# EAGLE board csa_petcpu_v1.1b (EAGLE 4.15), part 1 of 2
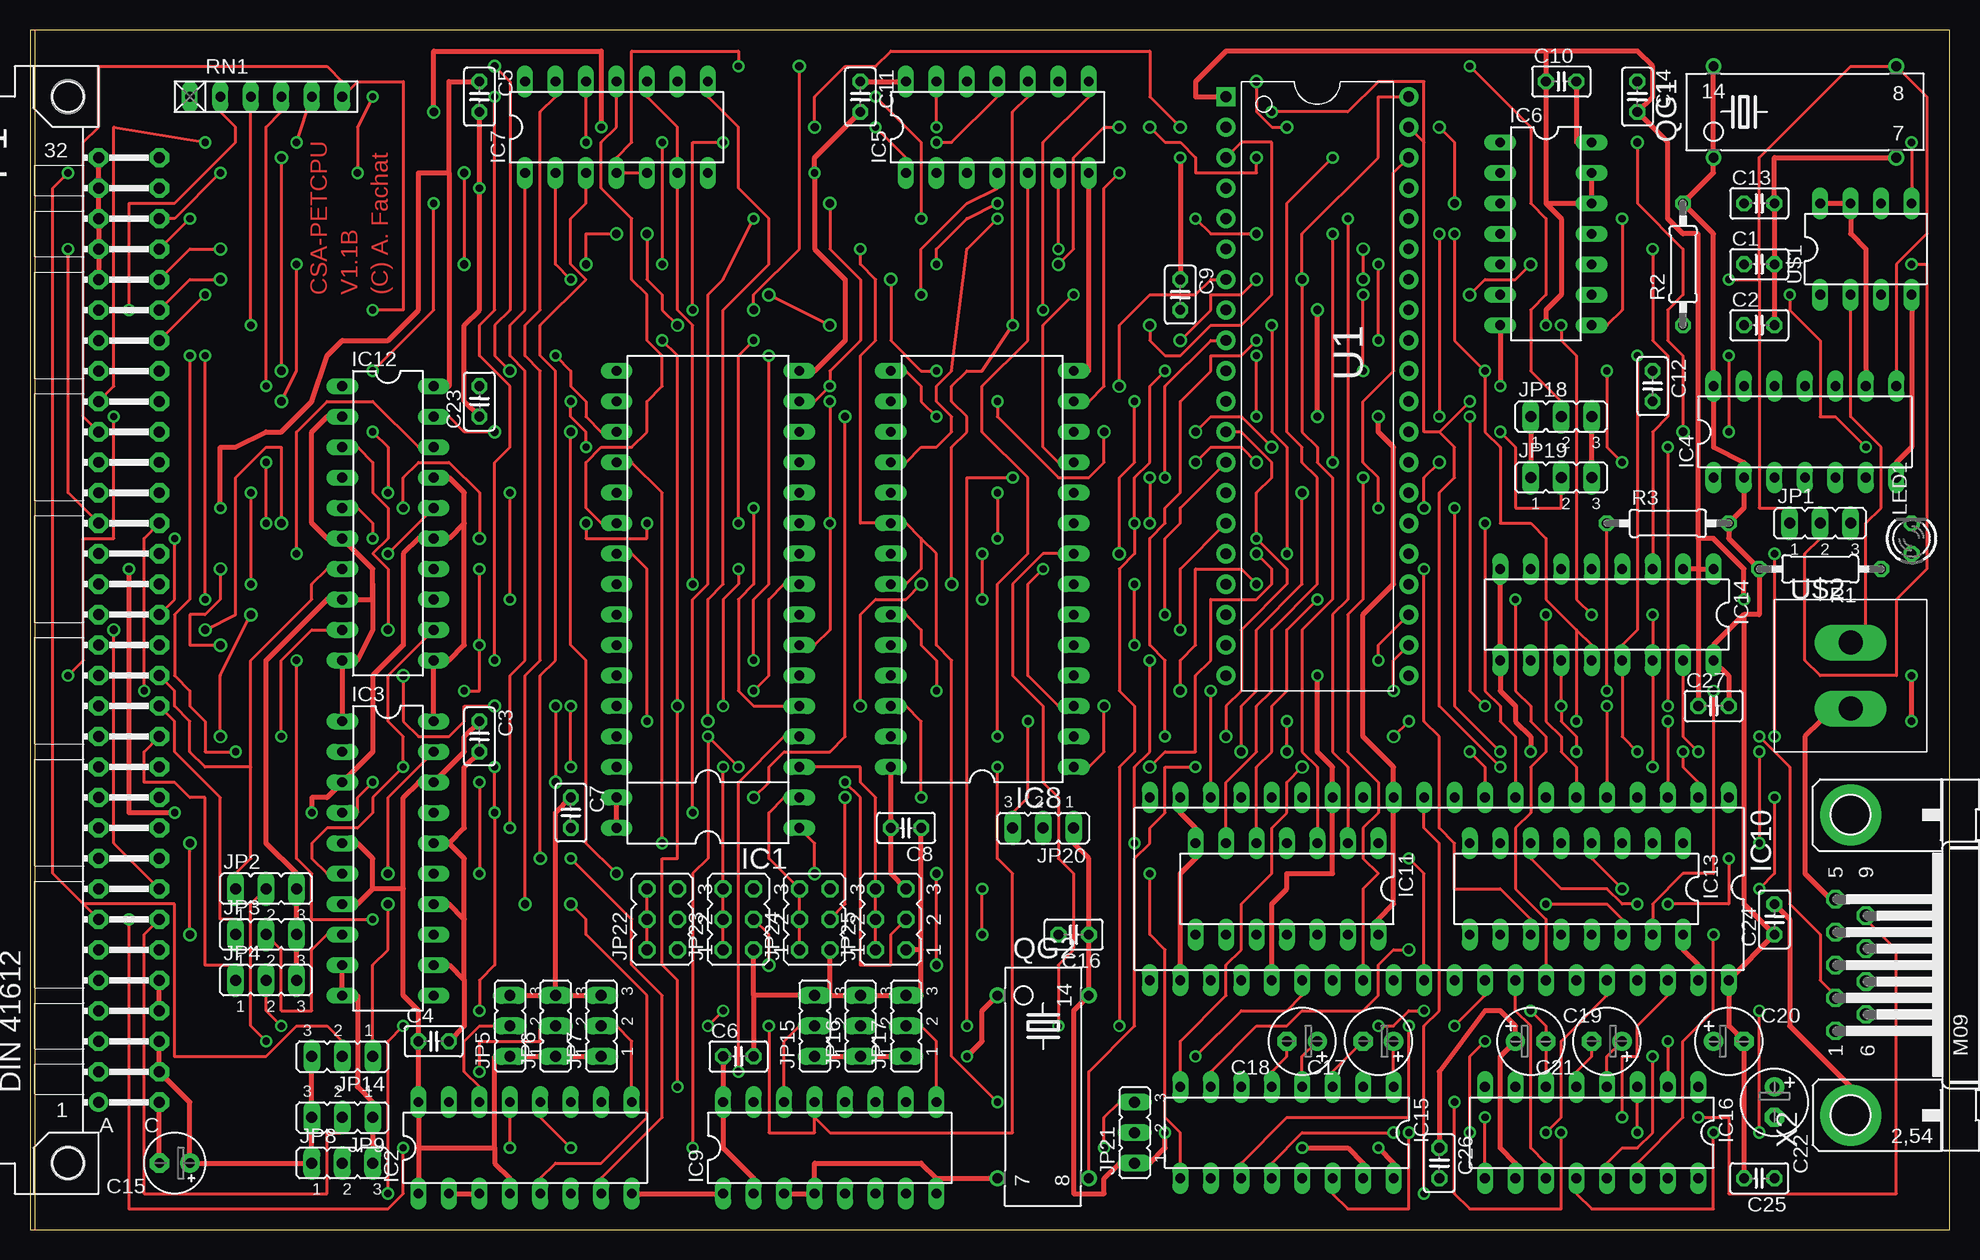
[diagram p2: board, top side]
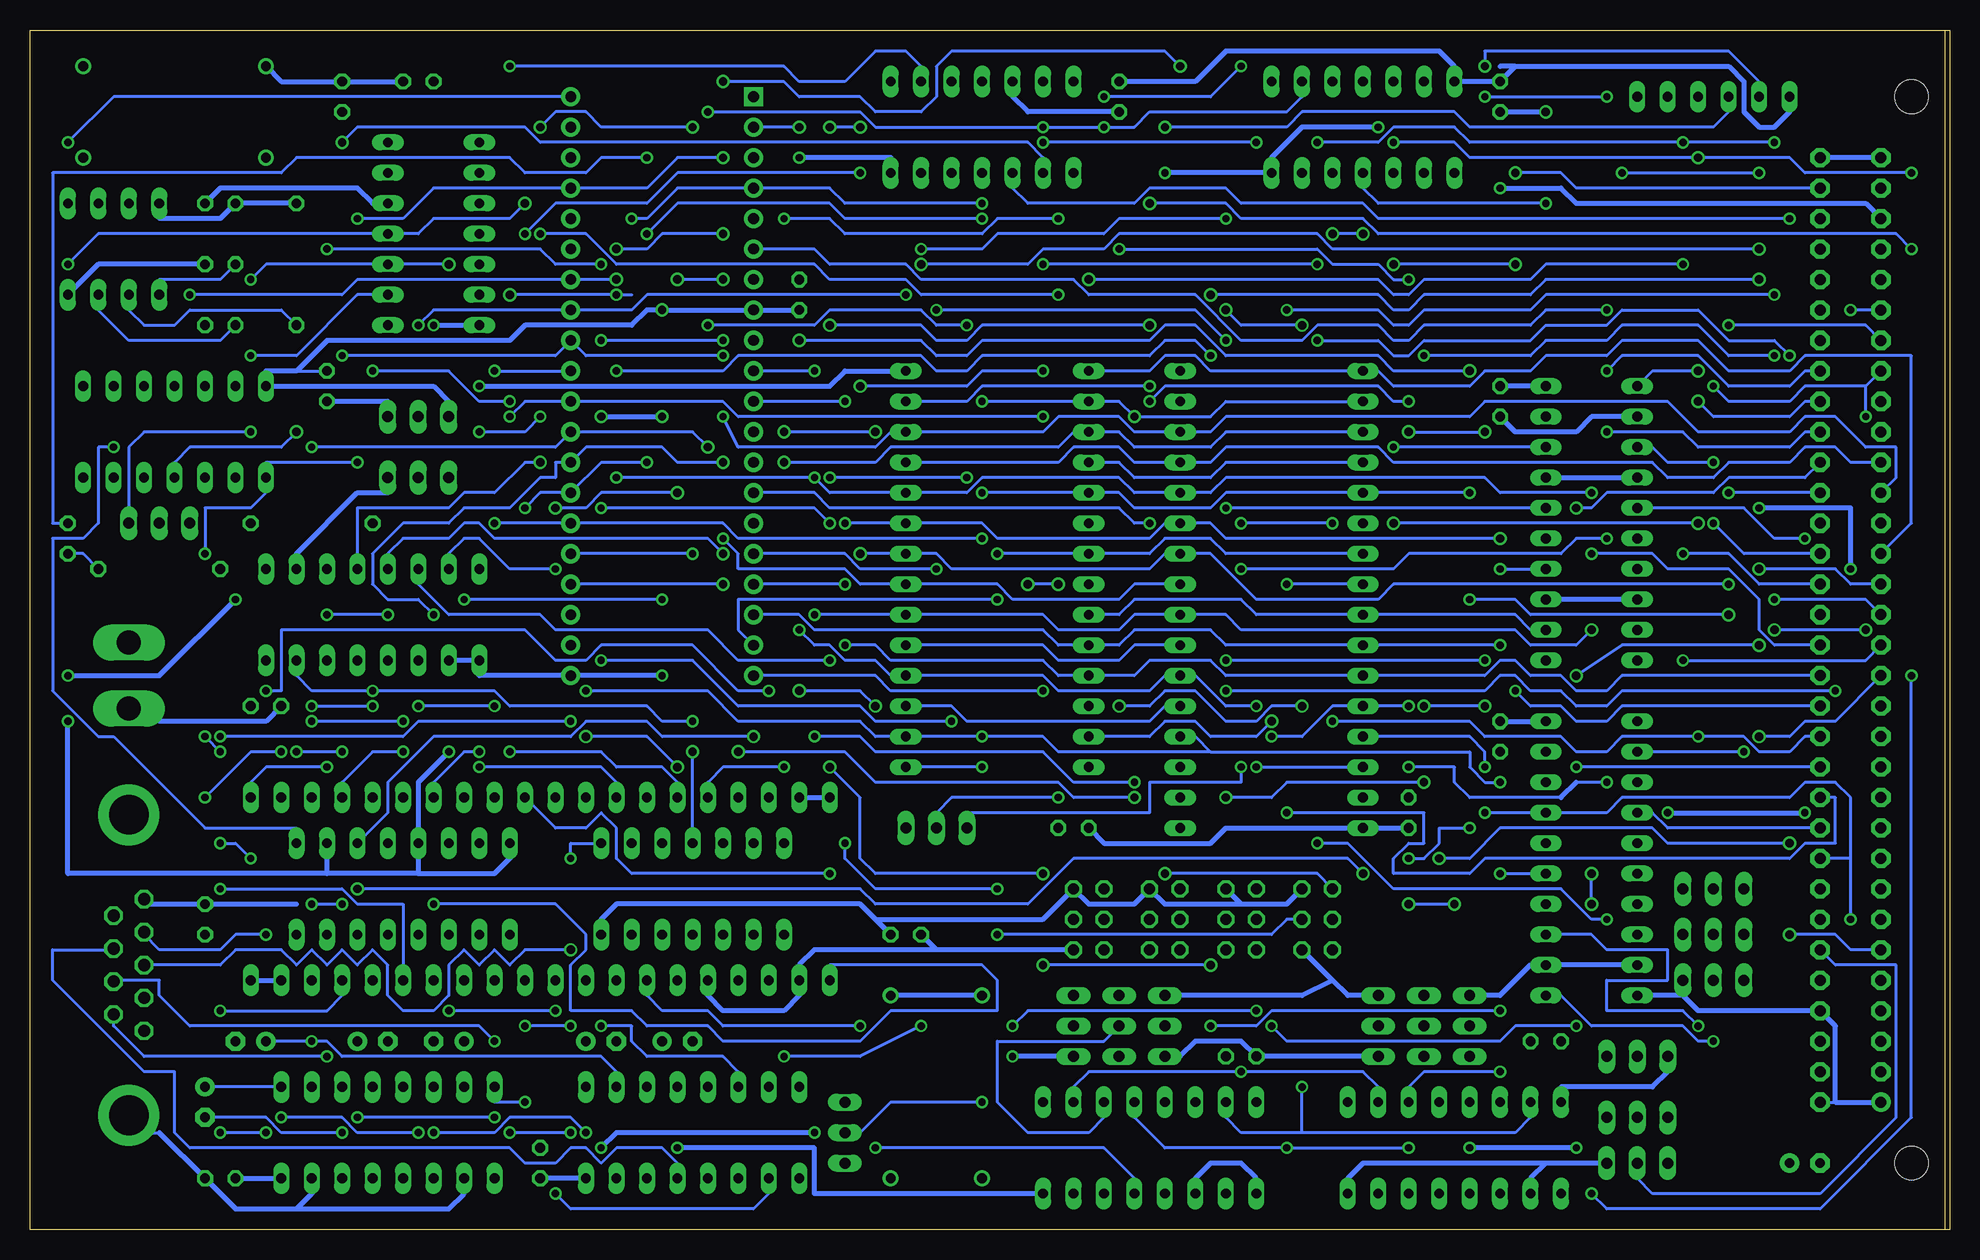
[diagram p3: board, bottom side, seen from below]

Size 160 x 100.03 mm. Coordinates in mm from the lower left corner, seen from the top.
Outline: 0,0.01 160,0.01 160,100.01 0,100.01 0,0.01
Copper layers (1*16): Top 0.035mm / dielectric 1.5mm / Bottom 0.035mm
Design rules "default": minimum track width 10mil, minimum drill 24mil, track to track 8mil, track to pad 8mil, pad to pad 8mil, via to via 8mil, smd to smd 8mil, copper to edge 40mil, drill to drill 8mil, minimum pad ring 10mil, minimum via ring 8mil, stop-mask expansion 4mil, vias tented up to drill 0mil, thermal gap 10mil

## Footprints (pad centres in the part's own frame; a part is rotated, then mirrored left to right if it is on the bottom)
C025-025X050 = drill 0.813 octagon: 1 -1.27,0; 2 1.27,0
E2,5-5 = drill 0.813 pad 1.6 round: + -1.27,0 | drill 0.813 pad 1.6 octagon: - 1.27,0
E2,5-6 = drill 0.813 pad 1.6 round: + -1.27,0 | drill 0.813 pad 1.6 octagon: - 1.27,0
DIL32OPT28 = drill 0.813 long: 1 -19.05,-7.62; 2 -16.51,-7.62; 3 -13.97,-7.62; 4 -11.43,-7.62; 5 -8.89,-7.62; 6 -6.35,-7.62; 7 -3.81,-7.62; 8 -1.27,-7.62; 9 1.27,-7.62; 10 3.81,-7.62; 11 6.35,-7.62; 12 8.89,-7.62; 13 11.43,-7.62; 14 13.97,-7.62; 15 16.51,-7.62; 16 19.05,-7.62; 17 19.05,7.62; 18 16.51,7.62; 19 13.97,7.62; 20 11.43,7.62; 21 8.89,7.62; 22 6.35,7.62; 23 3.81,7.62; 24 1.27,7.62; 25 -1.27,7.62; 26 -3.81,7.62; 27 -6.35,7.62; 28 -8.89,7.62; 29 -11.43,7.62; 30 -13.97,7.62; 31 -16.51,7.62; 32 -19.05,7.62
DIL16 = drill 0.813 long: 1 -8.89,-3.81; 2 -6.35,-3.81; 3 -3.81,-3.81; 4 -1.27,-3.81; 5 1.27,-3.81; 6 3.81,-3.81; 7 6.35,-3.81; 8 8.89,-3.81; 9 8.89,3.81; 10 6.35,3.81; 11 3.81,3.81; 12 1.27,3.81; 13 -1.27,3.81; 14 -3.81,3.81; 15 -6.35,3.81; 16 -8.89,3.81
DIL20 = drill 0.813 long: 1 -10.16,-3.81; 2 -7.62,-3.81; 3 -5.08,-3.81; 4 -2.54,-3.81; 5 0,-3.81; 6 2.54,-3.81; 7 5.08,-3.81; 8 7.62,-3.81; 9 10.16,-3.81; 10 12.7,-3.81; 11 12.7,3.81; 12 10.16,3.81; 13 7.62,3.81; 14 5.08,3.81; 15 2.54,3.81; 16 0,3.81; 17 -2.54,3.81; 18 -5.08,3.81; 19 -7.62,3.81; 20 -10.16,3.81
DIL14 = drill 0.813 long: 1 -7.62,-3.81; 2 -5.08,-3.81; 3 -2.54,-3.81; 4 0,-3.81; 5 2.54,-3.81; 6 5.08,-3.81; 7 7.62,-3.81; 8 7.62,3.81; 9 5.08,3.81; 10 2.54,3.81; 11 0,3.81; 12 -2.54,3.81; 13 -5.08,3.81; 14 -7.62,3.81
DIL28 = drill 0.813 long: 1 -13.97,-7.62; 2 -11.43,-7.62; 3 -8.89,-7.62; 4 -6.35,-7.62; 5 -3.81,-7.62; 6 -1.27,-7.62; 7 1.27,-7.62; 8 3.81,-7.62; 9 6.35,-7.62; 10 8.89,-7.62; 11 11.43,-7.62; 12 13.97,-7.62; 13 16.51,-7.62; 14 19.05,-7.62; 15 19.05,7.62; 16 16.51,7.62; 17 13.97,7.62; 18 11.43,7.62; 19 8.89,7.62; 20 6.35,7.62; 21 3.81,7.62; 22 1.27,7.62; 23 -1.27,7.62; 24 -3.81,7.62; 25 -6.35,7.62; 26 -8.89,7.62; 27 -11.43,7.62; 28 -13.97,7.62
DIL40 = drill 0.813 long: 1 -16.51,-7.62; 2 -13.97,-7.62; 3 -11.43,-7.62; 4 -8.89,-7.62; 5 -6.35,-7.62; 6 -3.81,-7.62; 7 -1.27,-7.62; 8 1.27,-7.62; 9 3.81,-7.62; 10 6.35,-7.62; 11 8.89,-7.62; 12 11.43,-7.62; 13 13.97,-7.62; 14 16.51,-7.62; 15 19.05,-7.62; 16 21.59,-7.62; 17 24.13,-7.62; 18 26.67,-7.62; 19 29.21,-7.62; 20 31.75,-7.62; 21 31.75,7.62; 22 29.21,7.62; 23 26.67,7.62; 24 24.13,7.62; 25 21.59,7.62; 26 19.05,7.62; 27 16.51,7.62; 28 13.97,7.62; 29 11.43,7.62; 30 8.89,7.62; 31 6.35,7.62; 32 3.81,7.62; 33 1.27,7.62; 34 -1.27,7.62; 35 -3.81,7.62; 36 -6.35,7.62; 37 -8.89,7.62; 38 -11.43,7.62; 39 -13.97,7.62; 40 -16.51,7.62
JP2 = drill 0.914 long: 1 -2.54,0; 2 0,0; 3 2.54,0
JP3Q = drill 0.914 octagon: 1 -2.54,-1.27; 2 -2.54,1.27; 3 0,-1.27; 4 0,1.27; 5 2.54,-1.27; 6 2.54,1.27
LED3MM = drill 0.813 octagon: A -1.27,0; K 1.27,0
CSABUS = drill 0.914 pad 1.6 round: A1 7.62,36.83 | drill 0.914 pad 1.6 octagon: A2 7.62,34.29; A3 7.62,31.75; A4 7.62,29.21; A5 7.62,26.67; A6 7.62,24.13; A7 7.62,21.59; A8 7.62,19.05; A9 7.62,16.51; A10 7.62,13.97; A11 7.62,11.43; A12 7.62,8.89; A13 7.62,6.35; A14 7.62,3.81; A15 7.62,1.27; A16 7.62,-1.27; A17 7.62,-3.81; A18 7.62,-6.35; A19 7.62,-8.89; A20 7.62,-11.43; A21 7.62,-13.97; A22 7.62,-16.51; A23 7.62,-19.05; A24 7.62,-21.59; A25 7.62,-24.13; A26 7.62,-26.67; A27 7.62,-29.21; A28 7.62,-31.75; A29 7.62,-34.29; A30 7.62,-36.83; A31 7.62,-39.37; A32 7.62,-41.91; C1 2.54,36.83; C2 2.54,34.29; C3 2.54,31.75; C4 2.54,29.21; C5 2.54,26.67; C6 2.54,24.13; C7 2.54,21.59; C8 2.54,19.05; C9 2.54,16.51; C10 2.54,13.97; C11 2.54,11.43; C12 2.54,8.89; C13 2.54,6.35; C14 2.54,3.81; C15 2.54,1.27; C16 2.54,-1.27; C17 2.54,-3.81; C18 2.54,-6.35; C19 2.54,-8.89; C20 2.54,-11.43; C21 2.54,-13.97; C22 2.54,-16.51; C23 2.54,-19.05; C24 2.54,-21.59; C25 2.54,-24.13; C26 2.54,-26.67; C27 2.54,-29.21; C28 2.54,-31.75; C29 2.54,-34.29; C30 2.54,-36.83; C31 2.54,-39.37; C32 2.54,-41.91 | hole 2.794: 10.16,41.91; 10.16,-46.99
SG51 = drill 0.813 round: 1 -7.62,-3.81; 7 7.62,-3.81; 8 7.62,3.81; 14 -7.62,3.81
0207/10 = drill 0.813 octagon: 1 -5.08,0; 2 5.08,0
RN-6 = drill 0.813 long: 1 -6.35,0; 2 -3.81,0; 3 -1.27,0; 4 1.27,0; 5 3.81,0; 6 6.35,0
DIP-40 = drill 0.889 pad 1.6 square: 1 -22.86,-7.62 | drill 0.889 pad 1.6 round: 2 -20.32,-7.62; 3 -17.78,-7.62; 4 -15.24,-7.62; 5 -12.7,-7.62; 6 -10.16,-7.62; 7 -7.62,-7.62; 8 -5.08,-7.62; 9 -2.54,-7.62; 10 0,-7.62; 11 2.54,-7.62; 12 5.08,-7.62; 13 7.62,-7.62; 14 10.16,-7.62; 15 12.7,-7.62; 16 15.24,-7.62; 17 17.78,-7.62; 18 20.32,-7.62; 19 22.86,-7.62; 20 25.4,-7.62; 21 25.4,7.62; 22 22.86,7.62; 23 20.32,7.62; 24 17.78,7.62; 25 15.24,7.62; 26 12.7,7.62; 27 10.16,7.62; 28 7.62,7.62; 29 5.08,7.62; 30 2.54,7.62; 31 0,7.62; 32 -2.54,7.62; 33 -5.08,7.62; 34 -7.62,7.62; 35 -10.16,7.62; 36 -12.7,7.62; 37 -15.24,7.62; 38 -17.78,7.62; 39 -20.32,7.62; 40 -22.86,7.62
DIL08 = drill 0.813 long: 1 -11.43,-2.54; 2 -8.89,-2.54; 3 -6.35,-2.54; 4 -3.81,-2.54; 5 -3.81,5.08; 6 -6.35,5.08; 7 -8.89,5.08; 8 -11.43,5.08
TASTER = drill 2.007 long: 1 0,4.013; 3 0,-1.473
M09HP = drill 1.016 octagon: 1 -5.486,1.27; 2 -2.743,1.27; 3 0,1.27; 4 2.743,1.27; 5 5.486,1.27; 6 -4.115,-1.27; 7 -1.372,-1.27; 8 1.372,-1.27; 9 4.115,-1.27 | drill 3.302 pad 5.08 round: G1 -12.522,0; G2 12.522,0

## Placement (x,y rotation side)
C1  100n  [C025-025X050]  144.14,80.49 0 top
C2  100n  [C025-025X050]  144.14,75.41 0 top
C3  100n  [C025-025X050]  37.46,41.12 270 top
C4  100n  [C025-025X050]  33.65,15.72 0 top
C5  100n  [C025-025X050]  37.46,94.46 270 top
C6  100n  [C025-025X050]  59.05,14.45 0 top
C7  100n  [C025-025X050]  45.08,34.77 270 top
C8  100n  [C025-025X050]  73.02,33.5 180 top
C9  100n  [C025-025X050]  95.88,77.95 270 top
C10  100n  [C025-025X050]  127.63,95.73 0 top
C11  100n  [C025-025X050]  69.21,94.46 270 top
C12  100n  [C025-025X050]  135.25,70.33 270 top
C13  100n  [C025-025X050]  144.14,85.57 0 top
C14  100n  [C025-025X050]  133.98,94.46 270 top
C15  47u  [E2,5-5]  12.06,5.56 180 top
C16  100n  [C025-025X050]  86.99,24.61 180 top
C17  1u  [E2,5-6]  112.39,15.72 180 top
C18  1u  [E2,5-6]  106.04,15.72 180 top
C19  4u7  [E2,5-6]  125.09,15.72 0 top
C20  4u7  [E2,5-6]  141.6,15.72 0 top
C21  1u  [E2,5-6]  131.44,15.72 180 top
C22  1u  [E2,5-6]  145.41,10.64 270 top
C23  100n  [C025-025X050]  37.46,69.06 90 top
C24  100n  [C025-025X050]  145.41,25.88 90 top
C25  100n  [C025-025X050]  144.14,4.29 180 top
C26  100n  [C025-025X050]  117.47,5.56 270 top
C27  100n  [C025-025X050]  140.33,43.66 0 top
IC1  ROMSOCK32TO512K  [DIL32OPT28]  56.51,52.55 90 top
IC2  74LS85N  [DIL16]  41.27,6.83 0 top
IC3  74LS688BUSOPT  [DIL20]  29.84,32.23 270 top
IC4  74LS164N  [DIL14]  147.95,66.52 0 top
IC5  74LS86N  [DIL14]  80.64,91.92 0 top
IC6  74LS293N  [DIL14]  126.36,83.03 270 top
IC7  74LS00N  [DIL14]  48.89,91.92 0 top
IC8  RAMSOCKET8OR32K  [DIL28]  79.37,52.55 90 top
IC9  74LS85N  [DIL16]  66.67,6.83 0 top
IC10  UART  [DIL40]  125.09,28.42 180 top
IC11  74LS06N  [DIL14]  104.77,28.42 180 top
IC12  74LS688BUSOPT  [DIL20]  29.84,60.17 270 top
IC13  74LS138N  [DIL16]  128.9,28.42 180 top
IC14  74HCT173N  [DIL16]  131.44,51.28 180 top
IC15  MAX232  [DIL16]  104.77,8.1 180 top
IC16  MAX232  [DIL16]  130.17,8.1 180 top
JP1  [JP2]  149.22,58.9 0 top
JP2  [JP2]  19.68,28.42 0 top
JP3  [JP2]  19.68,24.61 0 top
JP4  [JP2]  19.68,20.8 0 top
JP5  [JP2]  40,16.99 90 top
JP6  [JP2]  43.81,16.99 90 top
JP7  [JP2]  47.62,16.99 90 top
JP8  [JP2]  26.03,5.56 0 top
JP9  [JP2]  26.03,9.37 180 top
JP14  [JP2]  26.03,14.45 180 top
JP15  [JP2]  65.4,16.99 90 top
JP16  [JP2]  69.21,16.99 90 top
JP17  [JP2]  73.02,16.99 90 top
JP18  [JP2]  127.63,67.79 0 top
JP19  [JP2]  127.63,62.71 0 top
JP20  [JP2]  84.45,33.5 180 top
JP21  [JP2]  92.07,8.1 90 top
JP22  [JP3Q]  52.7,25.88 90 top
JP23  [JP3Q]  59.05,25.88 90 top
JP24  [JP3Q]  65.4,25.88 90 top
JP25  [JP3Q]  71.75,25.88 90 top
LED1  [LED3MM]  156.84,57.63 90 top
P1  CSABUS  [CSABUS]  13.33,47.47 180 top
QG1  16MHz  [SG51]  147.95,93.19 0 top
QG2  1,8432MHz  [SG51]  84.45,11.91 270 top
R1  240  [0207/10]  149.22,55.09 180 top
R2  10k  [0207/10]  137.79,80.49 90 top
R3  10k  [0207/10]  136.52,58.9 0 top
RN1  10k  [RN-6]  19.68,94.46 0 top
U1  [DIP-40]  107.31,71.6 270 top
U$1  TL7705  [DIL08]  160.65,80.49 0 top
U$2  TASTER  [TASTER]  151.76,44.93 0 top
X2  [M09HP]  151.76,22.07 90 top